# EAGLE design vfd. v1.1brd (EAGLE 5.09)
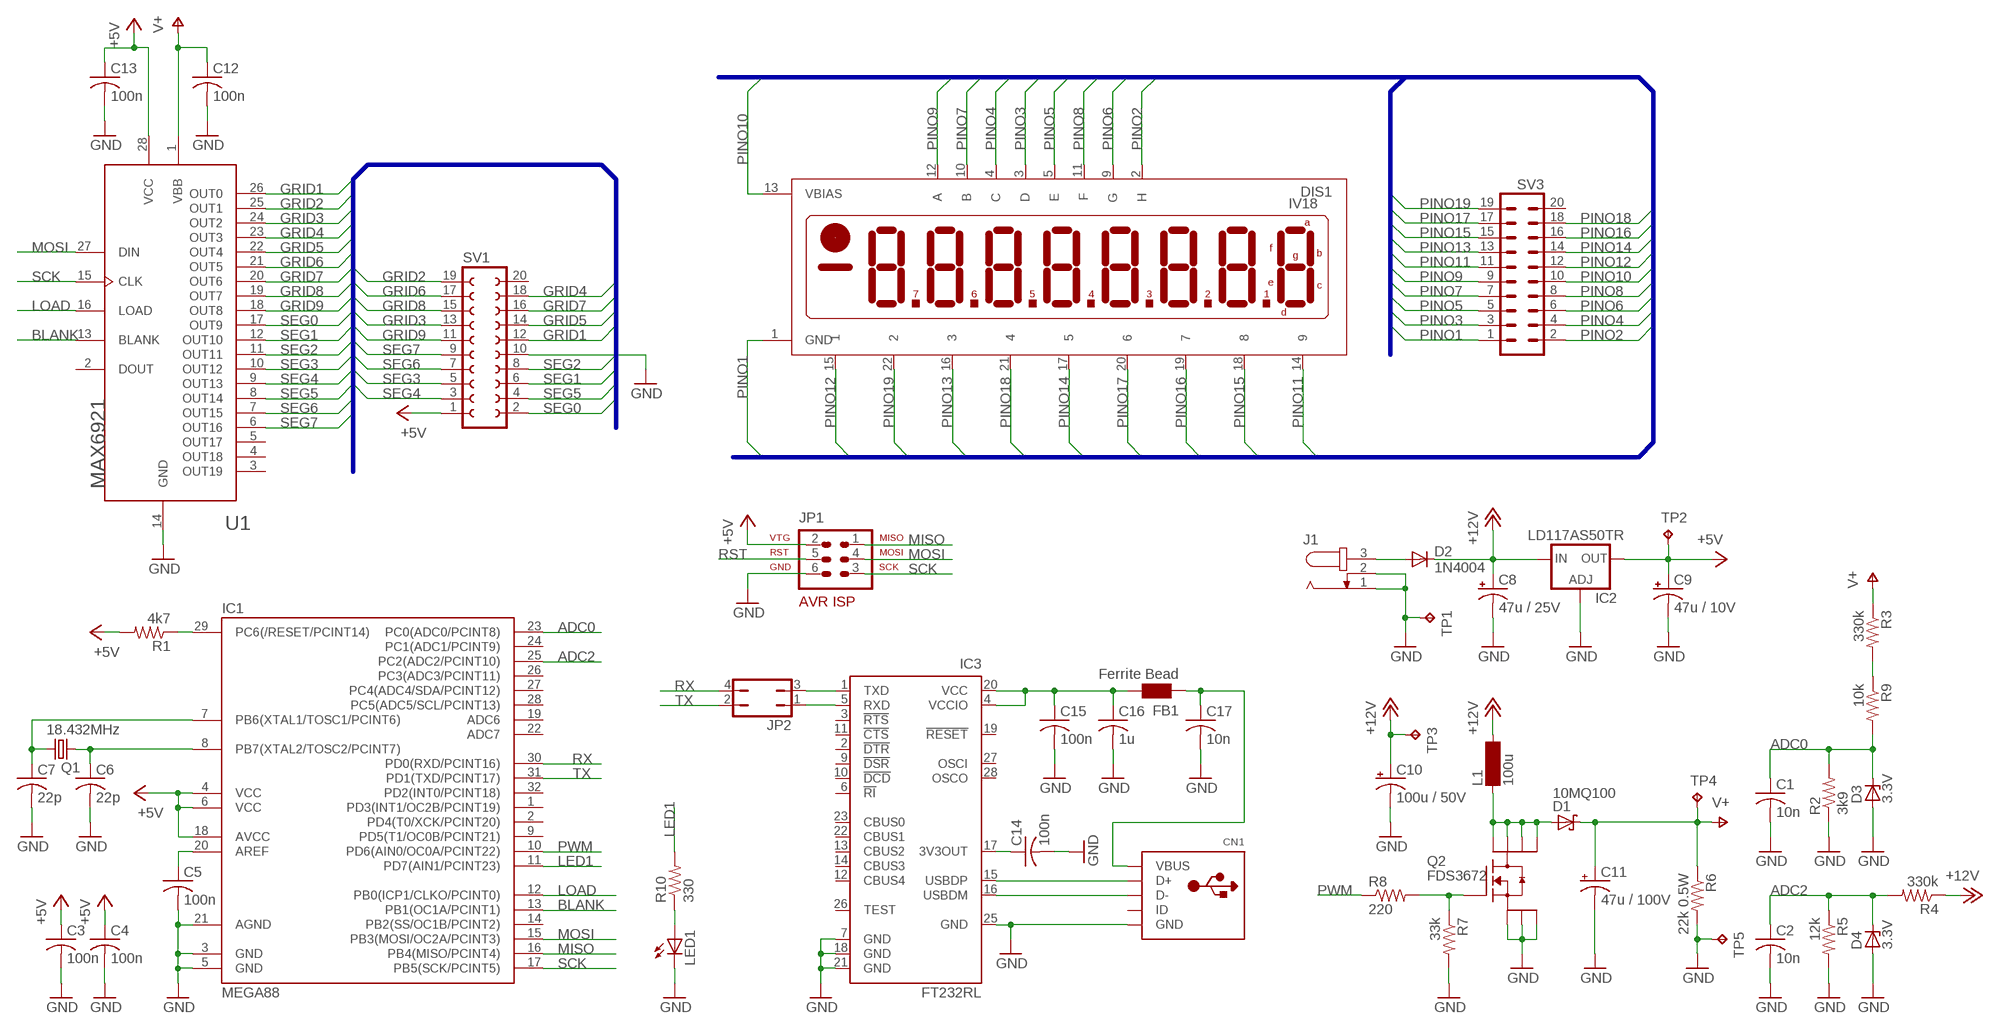
[diagram p0: schematic, sheet 1]

## Parts
C1  10n  C-USC0805  [C0805]
C2  10n  C-USC0805  [C0805]
C3  100n  C-USC0805  [C0805]
C4  100n  C-USC0805  [C0805]
C5  100n  C-USC0805  [C0805]
C6  22p  C-USC0805  [C0805]
C7  22p  C-USC0805  [C0805]
C8  47u / 25V  CPOL-USUD-6,3X5,8  [UD-6,3X5,8_NICHICON]
C9  47u / 10V  CPOL-USUD-6,3X5,8  [UD-6,3X5,8_NICHICON]
C10  100u / 50V  CPOL-USE3.5-8  [E3,5-8]
C11  47u / 100V  CPOL-USE3.5-10  [E3,5-10]
C12  100n  C-US075-032X103  [C075-032X103]
C13  100n  C-USC0805  [C0805]
C14  100n  C-USC0805  [C0805]
C15  100n  C-USC0805  [C0805]
C16  1u  C-USC0805  [C0805]
C17  10n  C-USC0805  [C0805]
CN1  USBMINIB  [USB-MINIB]
D1  10MQ100  [SMA(DO-214AC)]
D2  1N4004  [DO41-10]
D3  3.3V  ZENER-DIODESOD80C  [SOD80C]
D4  3.3V  ZENER-DIODESOD80C  [SOD80C]
DIS1  IV18  [IV18]
FB1  Ferrite Bead  WE-CBF_0603  [0603]
IC1  MEGA88  MEGA48/88/168-AU  [TQFP32-08]
IC2  LD117AS50TR  [SOT223]
IC3  FT232RL  [SSOP28]
J1  JACK-PLUG1  [SPC4078]
JP1  AVR-ISP-6  [AVR-ISP-6]
JP2  JP2Q  [JP2Q]
L1  100u  BS11  [BS11]
LED1  LEDCHIPLED_0805  [CHIPLED_0805]
Q1  18.432MHz  CRYSTALHC49UP  [HC49UP]
Q2  FDS3672  [SO08]
R1  4k7  R-US_R0805  [R0805]
R2  3k9  R-US_R0805  [R0805]
R3  330k  R-US_R0805  [R0805]
R4  330k  R-US_R0805  [R0805]
R5  12k  R-US_R0805  [R0805]
R6  22k 0.5W  R-US_0207/10  [0207/10]
R7  33k  R-US_R0805  [R0805]
R8  220  R-US_R0805  [R0805]
R9  10k  R-US_R0805  [R0805]
R10  330  R-US_R0805  [R0805]
SV1  FE10-2  [FE10-2]
SV3  MA10-2W  [MA10-2W]
TP1  TPPAD1-13  [P1-13]
TP2  TPPAD1-13  [P1-13]
TP3  TPPAD1-13  [P1-13]
TP4  TPPAD1-13  [P1-13]
TP5  TPPAD1-13  [P1-13]
U1  MAX6921W  [SO28W]
U$1  DC-JACK-POLARITY+  [DC-JACK-POL]  (not placed on a sheet)

## Nets
+5V: C3.1 C4.1 C9.+ C13.1 IC1.4(VCC) IC1.6(VCC) IC1.18(AVCC) IC2.4(OUT) JP1.2 R1.2 SV1.1 TP2.TP U1.28(VCC)
+12V: C8.+ C10.+ D2.C IC2.3(IN) L1.2 R4.1 TP3.TP
ADC0: C1.1 D3.C IC1.23(PC0(ADC0/PCINT8)) R2.2 R9.2
ADC2: C2.1 D4.C IC1.25(PC2(ADC2/PCINT10)) R4.2 R5.1
BLANK: IC1.13(PB1(OC1A/PCINT1)) U1.13(BLANK)
GND: C1.2 C2.2 C3.2 C4.2 C5.2 C6.2 C7.2 C8.- C9.- C10.- C11.- C12.2 C13.2 C14.2 C15.2 C16.2 C17.2 CN1.GND D3.A D4.A IC1.3(GND) IC1.5(GND) IC1.21(AGND) IC2.1(ADJ) IC3.7(GND) IC3.18(GND) IC3.21(GND) IC3.25(GND) J1.1 J1.2 JP1.6 LED1.C Q2.1(S1) Q2.2(S2) Q2.3(S3) R2.1 R5.2 R6.2 R7.2 SV1.10 TP1.TP TP5.TP U1.14(GND)
GRID1: SV1.12 U1.26(OUT0)
GRID2: SV1.19 U1.25(OUT1)
GRID3: SV1.13 U1.24(OUT2)
GRID4: SV1.18 U1.23(OUT3)
GRID5: SV1.14 U1.22(OUT4)
GRID6: SV1.17 U1.21(OUT5)
GRID7: SV1.16 U1.20(OUT6)
GRID8: SV1.15 U1.19(OUT7)
GRID9: SV1.11 U1.18(OUT8)
LED1: IC1.11(PD7(AIN1/PCINT23)) R10.2
LOAD: IC1.12(PB0(ICP1/CLKO/PCINT0)) U1.16(LOAD)
MISO: IC1.16(PB4(MISO/PCINT4)) JP1.1
MOSI: IC1.15(PB3(MOSI/OC2A/PCINT3)) JP1.4 U1.27(DIN)
N$1: D2.A J1.3
N$2: C5.1 IC1.20(AREF)
N$3: C6.1 IC1.8(PB7(XTAL2/TOSC2/PCINT7)) Q1.1
N$4: C7.1 IC1.7(PB6(XTAL1/TOSC1/PCINT6)) Q1.2
N$5: D1.A L1.1 Q2.5(D1) Q2.6(D2) Q2.7(D3) Q2.8(D4)
N$6: CN1.D+ IC3.15(USBDP)
N$7: CN1.D- IC3.16(USBDM)
N$8: C15.1 C16.1 FB1.2 IC3.4(VCCIO) IC3.20(VCC)
N$9: C17.1 CN1.VBUS FB1.1
N$10: C14.1 IC3.17(3V3OUT)
N$11: LED1.A R10.1
N$12: IC3.1(TXD) JP2.3
N$13: IC3.5(RXD) JP2.1
N$14: Q2.4(G1) R7.1 R8.2
N$15: R3.2 R9.1
PINO1: DIS1.1(GND) SV3.1
PINO2: DIS1.2(H) SV3.2
PINO3: DIS1.3(D) SV3.3
PINO4: DIS1.4(C) SV3.4
PINO5: DIS1.5(E) SV3.5
PINO6: DIS1.9(G) SV3.6
PINO7: DIS1.10(B) SV3.7
PINO8: DIS1.11(F) SV3.8
PINO9: DIS1.12(A) SV3.9
PINO10: DIS1.13(VBIAS) SV3.10
PINO11: DIS1.14 SV3.11
PINO12: DIS1.15 SV3.12
PINO13: DIS1.16 SV3.13
PINO14: DIS1.17 SV3.14
PINO15: DIS1.18 SV3.15
PINO16: DIS1.19 SV3.16
PINO17: DIS1.20 SV3.17
PINO18: DIS1.21 SV3.18
PINO19: DIS1.22 SV3.19
PWM: IC1.10(PD6(AIN0/OC0A/PCINT22)) R8.1
RST: IC1.29(PC6(/RESET/PCINT14)) JP1.5 R1.1
RX: IC1.30(PD0(RXD/PCINT16)) JP2.4
SCK: IC1.17(PB5(SCK/PCINT5)) JP1.3 U1.15(CLK)
SEG0: SV1.2 U1.17(OUT9)
SEG1: SV1.6 U1.12(OUT10)
SEG2: SV1.8 U1.11(OUT11)
SEG3: SV1.5 U1.10(OUT12)
SEG4: SV1.3 U1.9(OUT13)
SEG5: SV1.4 U1.8(OUT14)
SEG6: SV1.7 U1.7(OUT15)
SEG7: SV1.9 U1.6(OUT16)
TX: IC1.31(PD1(TXD/PCINT17)) JP2.2
V+: C11.+ C12.1 D1.C R3.1 R6.1 TP4.TP U1.1(VBB)
Unconnected: CN1.ID IC1.1(PD3(INT1/OC2B/PCINT19)) IC1.2(PD4(T0/XCK/PCINT20)) IC1.9(PD5(T1/OC0B/PCINT21)) IC1.14(PB2(SS/OC1B/PCINT2)) IC1.19(ADC6) IC1.22(ADC7) IC1.24(PC1(ADC1/PCINT9)) IC1.26(PC3(ADC3/PCINT11)) IC1.27(PC4(ADC4/SDA/PCINT12)) IC1.28(PC5(ADC5/SCL/PCINT13)) IC1.32(PD2(INT0/PCINT18)) IC3.2(!DTR) IC3.3(!RTS) IC3.6(!RI) IC3.9(!DSR) IC3.10(!DCD) IC3.11(!CTS) IC3.12(CBUS4) IC3.13(CBUS2) IC3.14(CBUS3) IC3.19(!RESET) IC3.22(CBUS1) IC3.23(CBUS0) IC3.26(TEST) IC3.27(OSCI) IC3.28(OSCO) SV1.20 SV3.20 U1.2(DOUT) U1.3(OUT19) U1.4(OUT18) U1.5(OUT17)

## Buses
SEG[0..7],GRID[1..9]
PINO[1..19]

## Library data of the parts
C1-C7 C12-C17 = rcl:C-US: CAPACITOR, American symbol
C8-C11 = rcl:CPOL-US: POLARIZED CAPACITOR, American symbol
CN1 = adafruit:USB: USB Connectors USBMINIB - Surface Mount Female Mini-B USB Connector 4UConnector: 06564 By microbuilder.eu Thru-hole RA Female Mini-B USB Connector 4UConnector: 18732 By ladyada.net
D1 = MeusComponentes:10MQ100: Schottky Rectifier, 2.1 A - 100V
D2 = diode-1:1N4004: DIODE general purpose rectifier, 1 A
D3 D4 = diode:ZENER-DIODE: Z-Diode
DIS1 = adafruit:IV18: LCD DISPLAY 8-character 7 segment
FB1 = wuerth-elektronik:WE-CBF: SMD EMI Suppression Ferrite Beads - excellent anti-EMI properties - low DCR - impedances till 3000 ohms - rated current up to 6 A
IC1 = avr-6:MEGA48/88/168
IC2 = v-reg:LD117A?*: Low drop fixed and adjustable positive voltage regulators 1 A Source: http://www.st.com/stonline/products/literature/ds/7194/ld1117axx.pdf
IC3 = ftdichip:FT232R: Source: http://www.ftdichip.com/Documents/DataSheets/DS_FT232R_v104.pdf
J1 = con-jack:JACK-PLUG: DC POWER JACK Power Jack, DC, Right Angle, Through Hole, Rated 5A at 16VDC, PC Terminals Distributor: Farnell (www.Farnell.de) Drawing: 84N1161.pdf / 84N1162.pdf Manufacturer: SPC Technology (www.spctechnology.com) Type: SPC4077 / SPC 4078
JP1 = avr-6:AVR-ISP-6: AVR ISP-6 Serial Programming Header
JP2 = jumper:JP2Q: JUMPER
L1 = inductor-neosid:BS: INDUCTOR nominal inductance, magnetically screened
LED1 = led:LED: LED OSRAM: - CHIPLED LG R971, LG N971, LY N971, LG Q971, LY Q971, LO R971, LY R971 LH N974, LH R974 LS Q976, LO Q976, LY Q976 LO Q996 - Hyper CHIPLED LW Q18S LB Q993, LB Q99A, LB R99A - SideLED LS A670, LO A670, LY A670, LG A670, LP A670 LB A673, LV A673, LT A673, LW A673 LH A674 LY A675 LS A676, LA A676, LO A676, LY A676, LW A676 LS A679, LY A679, LG A679 - Hyper Micro SIDELED® LS Y876, LA Y876, LO Y876, LY Y876 LT Y87S - SmartLED LW L88C, LW L88S LB L89C, LB L89S, LG L890 LS L89K, LO L89K, LY L89K LS L896, LA L896, LO L896, LY L896 - TOPLED LS T670, LO T670, LY T670, LG T670, LP T670 LSG T670, LSP T670, LSY T670, LOP T670, LYG T670 LG T671, LOG T671, LSG T671 LB T673, LV T673, LT T673, LW T673 LH T674 LS T676, LA T676, LO T676, LY T676, LB T676, LH T676, LSB T676, LW T676 LB T67C, LV T67C, LT T67C, LS T67K, LO T67K, LY T67K, LW E67C LS E67B, LA E67B, LO E67B, LY E67B, LB E67C, LV E67C, LT E67C LW T67C LS T679, LY T679, LG T679 LS T770, LO T770, LY T770, LG T770, LP T770 LB T773, LV T773, LT T773, LW T773 LH T774 LS E675, LA E675, LY E675, LS T675 LS T776, LA T776, LO T776, LY T776, LB T776 LHGB T686 LT T68C, LB T68C - Hyper Mini TOPLED® LB M676 - Mini TOPLED Santana® LG M470 LS M47K, LO M47K, LY M47K Source: http://www.osram.convergy.de LUXEON: - LUMILED® LXK2-PW12-R00, LXK2-PW12-S00, LXK2-PW14-U00, LXK2-PW14-V00 LXK2-PM12-R00, LXK2-PM12-S00, LXK2-PM14-U00 LXK2-PE12-Q00, LXK2-PE12-R00, LXK2-PE12-S00, LXK2-PE14-T00, LXK2-PE14-U00 LXK2-PB12-K00, LXK2-PB12-L00, LXK2-PB12-M00, LXK2-PB14-N00, LXK2-PB14-P00, LXK2-PB14-Q00 LXK2-PR12-L00, LXK2-PR12-M00, LXK2-PR14-Q00, LXK2-PR14-R00 LXK2-PD12-Q00, LXK2-PD12-R00, LXK2-PD12-S00 LXK2-PH12-R00, LXK2-PH12-S00 LXK2-PL12-P00, LXK2-PL12-Q00, LXK2-PL12-R00 Source: www.luxeon.com KINGBRIGHT: KA-3528ASYC Source: www.kingbright.com
Q1 = crystal:CRYSTAL: CRYSTAL
Q2 = MeusComponentes:FDS3672: N-Channel PowerTrench® MOSFET 100V, 7.5A, 22mR
R1-R10 = rcl:R-US_: RESISTOR, American symbol
SV1 = con-lsta:FE10-2: FEMALE HEADER
SV3 = con-lstb:MA10-2W: PIN HEADER
TP1-TP5 = testpad:TP: Test pad
U1 = adafruit:MAX6921: MAX6921 76V VFD driver. Can be cascaded, talk to it via SPI The DIL part is from Supertex (HV5812)
U$1 = MeusComponentes:DC-JACK-POLARITY+

## Board
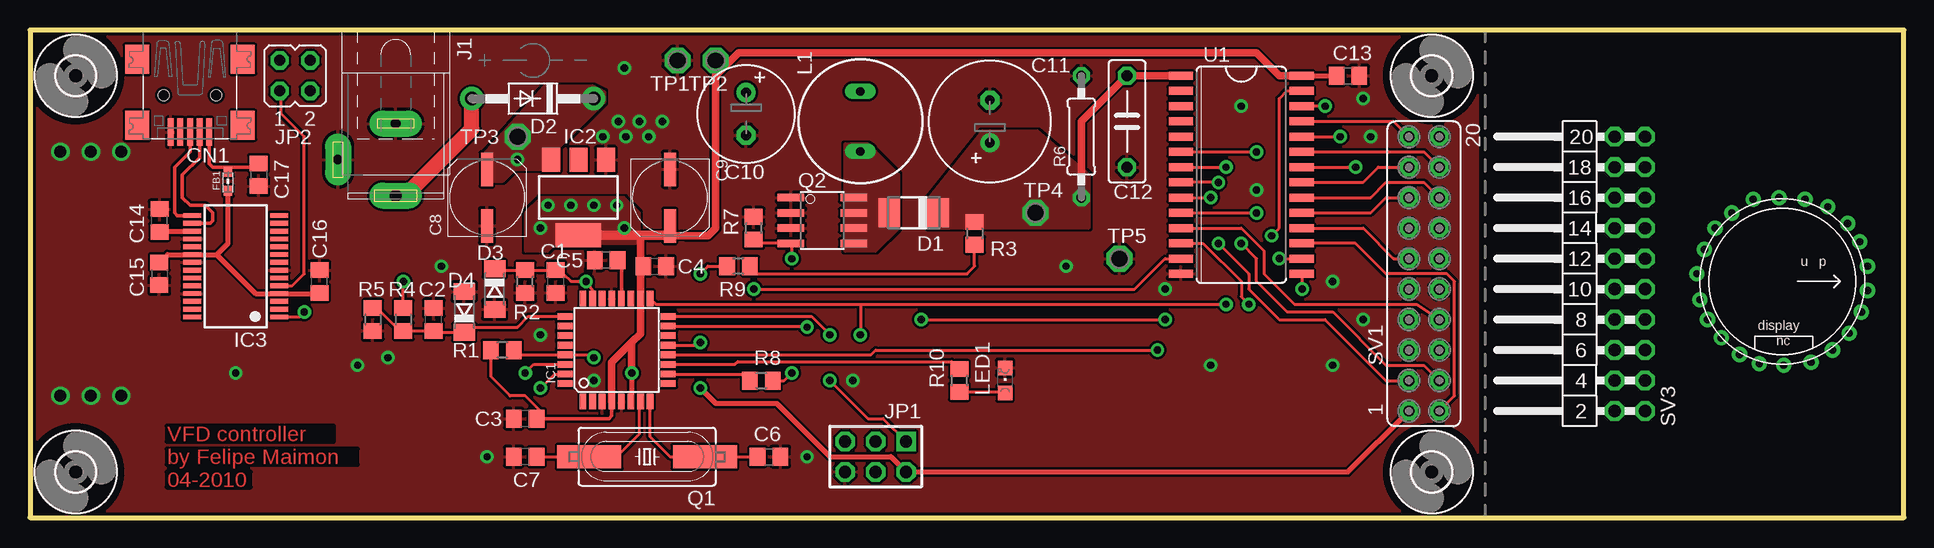
[diagram p1: board, top side]
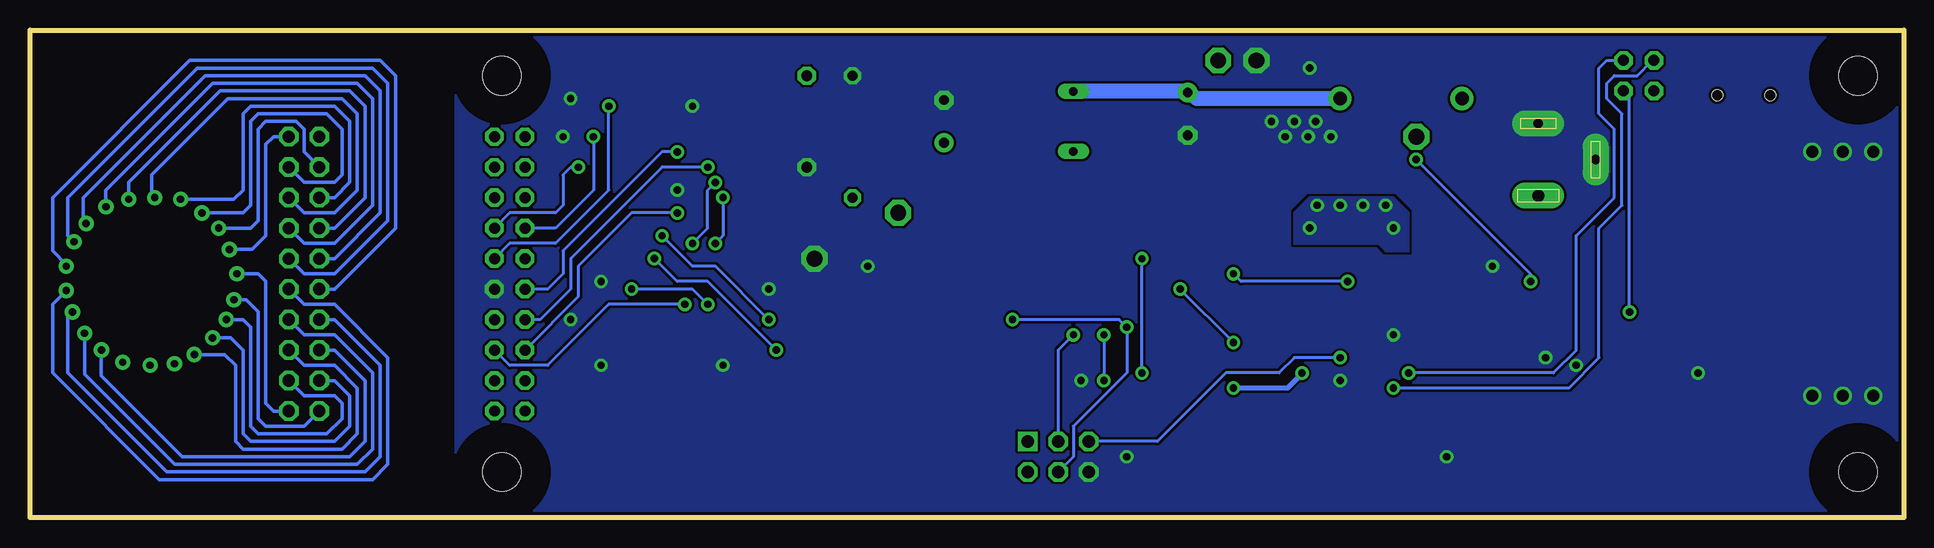
[diagram p2: board, bottom side, seen from below]

Size 156.19 x 40.64 mm. Coordinates in mm from the lower left corner, seen from the top.
Outline: 0,40.64 0,0 156.19,0 156.19,40.64 0,40.64
Copper layers (1*16): Top 0.035mm / dielectric 1.5mm / Bottom 0.035mm
Design rules "SparkFun": minimum track width 8mil, minimum drill 20mil, track to track 8mil, track to pad 8mil, pad to pad 8mil, via to via 8mil, smd to smd 8mil, copper to edge 10mil, drill to drill 8mil, minimum pad ring 12mil, minimum via ring 10mil, stop-mask expansion 4mil, vias tented up to drill 25mil, thermal gap 10mil

### Footprints (pad centres in the part's own frame; a part is rotated, then mirrored left to right if it is on the bottom)
C0805 = smd 1.3 x 1.5: 1 -0.95,0; 2 0.95,0
UD-6,3X5,8_NICHICON = smd 2.8 x 1: + 2.35,0; - -2.35,0
E3,5-8 = drill 0.813 pad 1.6 round: + -1.778,0 | drill 0.813 pad 1.6 octagon: - 1.778,0
E3,5-10 = drill 0.813 pad 1.6 round: + -1.778,0 | drill 0.813 pad 1.6 octagon: - 1.778,0
C075-032X103 = drill 0.914 octagon: 1 -3.81,0; 2 3.81,0
USB-MINIB = smd 0.5 x 2.308: D+ 0,4.064; D- -0.8,4.064; GND 1.6,4.064; ID 0.8,4.064; VBUS -1.6,4.064 | smd 2 x 2.4: GND1 -4.4,-2; GND2 -4.4,3.5; GND3 4.4,3.5; GND4 4.4,-2 | hole 0.9: -2.2,1; 2.2,1
SMA(DO-214AC) = smd 1.8 x 2.4: A -0.515,-1.27; C -4.565,-1.27
DO41-10 = drill 1.118 pad 1.93 round: A 5.08,0; C -5.08,0
SOD80C = smd 1.4 x 1.8: A 1.7,0; C -1.7,0
IV18 = drill 0.61 pad 1.27 round: 1 -0.635,-7.112; 2 1.524,-6.858; 3 3.175,-6.223; 4 4.699,-5.08; 5 6.096,-3.556; 6 6.858,-1.905; 7 6.985,0.127; 8 6.731,2.413; 9 5.715,4.191; 10 4.318,5.588; 11 2.54,6.604; 12 0.762,7.112; 13 -1.27,7.112; 14 -3.302,6.477; 15 -4.826,5.461; 16 -6.223,3.81; 17 -6.858,1.905; 18 -6.985,-0.254; 19 -6.858,-2.413; 20 -5.715,-4.191; 21 -4.445,-5.588; 22 -2.667,-6.477
0603 = smd 0.85 x 0.7: 1 -0.9,0; 2 0.7,0
TQFP32-08 = smd 1.27 x 0.559: 1 -4.293,2.8; 2 -4.293,2; 3 -4.293,1.2; 4 -4.293,0.4; 5 -4.293,-0.4; 6 -4.293,-1.2; 7 -4.293,-2; 8 -4.293,-2.8; 17 4.293,-2.8; 18 4.293,-2; 19 4.293,-1.2; 20 4.293,-0.4; 21 4.293,0.4; 22 4.293,1.2; 23 4.293,2; 24 4.293,2.8 | smd 0.559 x 1.27: 9 -2.8,-4.293; 10 -2,-4.293; 11 -1.2,-4.293; 12 -0.4,-4.293; 13 0.4,-4.293; 14 1.2,-4.293; 15 2,-4.293; 16 2.8,-4.293; 25 2.8,4.293; 26 2,4.293; 27 1.2,4.293; 28 0.4,4.293; 29 -0.4,4.293; 30 -1.2,4.293; 31 -2,4.293; 32 -2.8,4.293
SOT223 = smd 1.5 x 2: 1 -2.3,-3.15; 2 0,-3.15; 3 2.3,-3.15 | smd 3.8 x 2: 4 0,3.15
SSOP28 = smd 0.4 x 1.5: 1 -4.225,-3.625; 2 -3.575,-3.625; 3 -2.925,-3.625; 4 -2.275,-3.625; 5 -1.625,-3.625; 6 -0.975,-3.625; 7 -0.325,-3.625; 8 0.325,-3.625; 9 0.975,-3.625; 10 1.625,-3.625; 11 2.275,-3.625; 12 2.925,-3.625; 13 3.575,-3.625; 14 4.225,-3.625; 15 4.225,3.625; 16 3.575,3.625; 17 2.925,3.625; 18 2.275,3.625; 19 1.625,3.625; 20 0.975,3.625; 21 0.325,3.625; 22 -0.325,3.625; 23 -0.975,3.625; 24 -1.625,3.625; 25 -2.275,3.625; 26 -2.925,3.625; 27 -3.575,3.625; 28 -4.225,3.625
SPC4078 = drill 0.8 pad 2.184 long: 1 -3,0; 2 0,-4.8 | drill 1 pad 2.184 long: 3 3,0
AVR-ISP-6 = drill 1.016 square: 1 -2.54,-1.27 | drill 1.016 octagon: 2 -2.54,1.27; 3 0,-1.27; 4 0,1.27; 5 2.54,-1.27; 6 2.54,1.27
JP2Q = drill 0.914 octagon: 1 -1.27,-1.27; 2 -1.27,1.27; 3 1.27,-1.27; 4 1.27,1.27
BS11 = drill 0.7 long: 1 -2.5,0; 2 2.5,0
CHIPLED_0805 = smd 1.2 x 1.2: A 0,-1.05; C 0,1.05
HC49UP = smd 5.334 x 1.93: 1 -4.826,0; 2 4.826,0
SO08 = smd 0.61 x 2.21: 1 -1.905,-2.616; 2 -0.635,-2.616; 3 0.635,-2.616; 4 1.905,-2.616; 5 1.905,2.616; 6 0.635,2.616; 7 -0.635,2.616; 8 -1.905,2.616
R0805 = smd 1.3 x 1.5: 1 -0.95,0; 2 0.95,0
0207/10 = drill 0.813 octagon: 1 -5.08,0; 2 5.08,0
FE10-2 = drill 0.914 octagon: 1 -11.43,1.27; 2 -11.43,-1.27; 3 -8.89,1.27; 4 -8.89,-1.27; 5 -6.35,1.27; 6 -6.35,-1.27; 7 -3.81,1.27; 8 -3.81,-1.27; 9 -1.27,1.27; 10 -1.27,-1.27; 11 1.27,1.27; 12 1.27,-1.27; 13 3.81,1.27; 14 3.81,-1.27; 15 6.35,1.27; 16 6.35,-1.27; 17 8.89,1.27; 18 8.89,-1.27; 19 11.43,1.27; 20 11.43,-1.27
MA10-2W = drill 1.016 octagon: 1 -11.43,-1.27; 2 -11.43,1.27; 3 -8.89,-1.27; 4 -8.89,1.27; 5 -6.35,-1.27; 6 -6.35,1.27; 7 -3.81,-1.27; 8 -3.81,1.27; 9 -1.27,-1.27; 10 -1.27,1.27; 11 1.27,-1.27; 12 1.27,1.27; 13 3.81,-1.27; 14 3.81,1.27; 15 6.35,-1.27; 16 6.35,1.27; 17 8.89,-1.27; 18 8.89,1.27; 19 11.43,-1.27; 20 11.43,1.27
P1-13 = drill 1.321 pad 2.159 octagon: TP 0,0
SO28W = smd 0.66 x 2.032: 1 -8.255,-5.029; 2 -6.985,-5.029; 3 -5.715,-5.029; 4 -4.445,-5.029; 5 -3.175,-5.029; 6 -1.905,-5.029; 7 -0.635,-5.029; 8 0.635,-5.029; 9 1.905,-5.029; 10 3.175,-5.029; 11 4.445,-5.029; 12 5.715,-5.029; 13 6.985,-5.029; 14 8.255,-5.029; 15 8.255,5.029; 16 6.985,5.029; 17 5.715,5.029; 18 4.445,5.029; 19 3.175,5.029; 20 1.905,5.029; 21 0.635,5.029; 22 -0.635,5.029; 23 -1.905,5.029; 24 -3.175,5.029; 25 -4.445,5.029; 26 -5.715,5.029; 27 -6.985,5.029; 28 -8.255,5.029
3,2 = hole 3.2: 0,0

### Placement (x,y rotation side)
C1  43.81,19.68 270 top
C2  33.66,16.51 90 top
C3  41.27,8.26 180 top
C4  52.07,20.95 0 top
C5  48.02,21.45 180 top
C6  61.59,5.08 0 top
C7  41.27,5.08 180 top
C8  38.1,26.67 90 top
C9  53.34,26.67 270 top
C10  59.69,33.66 270 top
C11  80.01,33.02 90 top
C12  91.44,33.02 270 top
C13  109.86,36.83 0 top
C14  10.79,24.77 90 top
C15  10.79,20.33 270 top
C16  24.13,19.68 90 top
C17  19.05,28.57 270 top
CN1  13.34,36.2 180 top
D1  71.12,24.13 180 top
D2  41.91,34.92 180 top
D3  38.73,19.05 270 top
D4  36.2,17.14 90 top
DIS1  146.05,19.68 270 top
FB1  16.51,27.94 270 top
IC1  48.9,13.97 90 top
IC2  45.72,26.67 180 top
IC3  17.14,20.95 90 top
J1  30.48,29.84 270 top
JP1  70.48,5.08 180 top
JP2  22.09,36.83 0 top
L1  69.22,33.02 90 top
LED1  81.28,11.43 0 top
Q1  51.44,5.08 180 top
Q2  66.04,24.77 270 top
R1  39.37,13.97 180 top
R2  41.27,19.68 90 top
R3  78.74,23.7 270 top
R4  31.11,16.51 270 top
R5  28.57,16.51 270 top
R6  87.63,31.75 90 top
R7  60.33,24.13 90 top
R8  60.96,11.43 0 top
R9  59.05,20.95 180 top
R10  77.47,11.43 90 top
SV1  116.2,20.32 90 top
SV3  133.35,20.32 90 top
TP1  53.98,38.1 180 top
TP2  57.15,38.1 180 top
TP3  40.64,31.75 0 top
TP4  83.82,25.4 0 top
TP5  90.81,21.59 0 top
U1  100.97,28.57 270 top
U$1  41.91,38.1 180 top
U$2  [3,2]  116.84,36.83 0 top
U$3  [3,2]  116.84,3.81 0 top
U$4  [3,2]  3.81,3.81 0 top
U$5  [3,2]  3.81,36.83 0 top

### Tracks (layer width: path | path; a pad name or v marks a point on that pad's centre or on a via)
+5V  (via drill 0.61)
  Top 0.254: R1.2 38.42,11.74 40.01,10.16 41.27,10.16 42.55,8.89 42.55,8.57 C3.1
  Top 0.305: 50.9,20.95 C4.1 | IC1.4 48.49,8.49 48.26,8.26 C3.1
  Top 0.406: U1.28 C13.1 | 50.9,23.4 54.61,23.5 | SV1.1 109.86,3.81 JP1.2 71.75,5.08 66.67,5.08 62.23,9.53 57.15,9.53 v55.88,10.79 | IC1.6 50.16,9.75 v50.16,12.06 | 44.45,23.5 45.7,23.5 IC2.4
  Top 0.61: IC1.4 48.49,12.94 50.16,14.61 | 53.34,23.5 54.61,23.5 56.52,23.5 57.15,24.13 57.15,36.83 | 50.9,23.4 50.9,20.95 IC1.18 50.9,15.34 50.16,14.61 | 57.15,36.83 59.05,38.73 102.23,38.73 104.14,36.83 U1.28 | 50.16,14.61 v50.16,12.06 | 57.15,36.83 TP2.TP
  Top 0.813: IC2.4 46.33,23.52 53.34,23.5 C9.+
  Bottom 0.406: v55.88,10.79 51.37,10.79 50.16,11.99 v50.16,12.06
  other vias: 43.18,26.04 42.55,24.13 45.09,26.04 46.99,26.04 48.9,26.04 49.53,24.13
  pour Top (no thermals): 43.81,22.86 50.8,22.86 50.8,25.4 49.53,26.67 42.55,26.67 41.27,25.4 41.27,22.23 43.18,22.23
  pour Bottom (no thermals): 41.27,22.23 41.27,25.4 42.55,26.67 49.53,26.67 50.8,25.4 50.8,22.86 43.81,22.86 43.18,22.23
+12V  (via drill 0.61)
  Top 0.254: R4.1 v31.11,19.68
  Bottom 0.254: v31.11,19.68 31.11,20.32 v40.64,29.84
  Bottom 1.27: L1.2 59.78,35.52 C10.+ 58.93,34.92 D2.C
  pour Top (no thermals): 37.76,28 37.76,30.23 42.89,36 46.89,36 47.89,35.5 47.89,34.63 44.12,30.86 44.12,29 40.39,29 39.39,28
ADC0  (via drill 0.6, 0.61)
  Top 0.254: IC1.23 46.9,18.95 v46.35,19.68 45.09,19.68 44.45,20.32 44.13,20.32 C1.1 R2.2 38.85,20.64 D3.C | R9.2 56.52,20.95 v55.88,20.32
  Bottom 0.254: v55.88,20.32 55.24,19.68 v46.35,19.68
ADC2
  Top 0.254: C2.1 R4.2 30.8,15.56 29.21,17.14 28.89,17.14 R5.1 | IC1.25 41.53,16.77 40.64,15.88 36.83,15.88 36.4,15.45 D4.C 33.77,15.45 C2.1 | C2.1 33.97,15.88
BLANK  (via drill 0.61)
  Top 0.254: U1.13 94.61,21.59 92.08,19.05 v60.33,19.05 | IC1.13 55.65,14.37 v55.88,14.61
  Bottom 0.254: v55.88,14.61 v60.33,19.05
GND  (via drill 0.61, 1)
  other vias: 42.55,15.24 46.99,11.43 38.1,5.08 64.77,5.08 17.14,12.06 29.84,13.34 34.29,20.95 100.97,34.29 98.42,12.7 86.36,20.95 108.58,12.7 102.23,27.3 94.61,19.05 111.12,34.92 49.53,37.47 49.03,33.02 50.8,33.02 52.7,33.02 47.76,31.75 49.66,31.75 51.57,31.75 2.54,10.16 5.08,10.16 2.54,30.48 5.08,30.48 7.62,30.48 7.62,10.16 108.58,19.68 111.12,16.51 111.76,31.75 27.3,12.7 68.58,11.43
  pour Top (rank 2): 0,0 0,40.64 120.65,40.64 120.65,0
  pour Bottom (rank 2, no thermals): 0,0 120.65,0 120.65,40.64 0,40.64
GRID1  (via drill 0.61)
  Top 0.254: v107.95,34.29 U1.26
  Bottom 0.254: SV1.12 116.2,22.86 112.39,22.86 107.95,27.3 v107.95,34.29
GRID2
  Top 0.254: U1.25 113.67,33.02 SV1.19
GRID3  (via drill 0.61)
  Top 0.254: U1.24 v109.22,31.75
  Bottom 0.254: SV1.13 112.39,24.13 109.22,27.3 v109.22,31.75
GRID4
  Top 0.254: SV1.18 116.2,30.48 U1.23
GRID5  (via drill 0.61)
  Top 0.254: U1.22 v110.49,29.21
  Bottom 0.254: SV1.14 116.2,25.4 112.39,25.4 111.76,26.04 111.76,28.57 111.12,29.21 v110.49,29.21
GRID6
  Top 0.254: U1.21 111.12,27.94 112.39,29.21 SV1.17
GRID7
  Top 0.254: SV1.16 116.2,27.94 113.03,27.94 111.76,26.67 U1.20
GRID8
  Top 0.254: SV1.15 113.03,26.67 111.76,25.4 U1.19
GRID9
  Top 0.254: U1.18 111.12,24.13 113.67,21.59 SV1.11
LED1
  Top 0.254: IC1.11 58.77,12.77 59,13 76.85,13 R10.2
LOAD  (via drill 0.61)
  Top 0.254: v104.14,21.59 U1.16 | IC1.12 70.08,13.57 70.48,13.97 v93.98,13.97
  Bottom 0.254: v104.14,21.59 102.23,19.68 99.69,19.68 v93.98,13.97
MISO  (via drill 0.61)
  Top 0.254: IC1.16 65.14,16.77 v66.67,15.24 | v66.67,11.43 69.85,8.26 71.12,8.26 JP1.1
  Bottom 0.254: v66.67,15.24 v66.67,11.43
MOSI  (via drill 0.61)
  Top 0.254: IC1.15 64.67,15.97 v64.77,15.88 | U1.27 104.78,35.56 104.14,34.92 104.14,24.13 v103.5,23.5 | v74.3,16.51 v94.61,16.51
  Bottom 0.254: JP1.4 69.22,5.08 69.22,7.62 64.77,12.06 v64.77,15.88 65.41,16.51 v74.3,16.51 | v103.5,23.5 100.97,20.95 99.06,20.95 v94.61,16.51
N$1
  Top 1.27: J1.3 31.29,26.84 36.83,32.38 D2.A
N$2
  Top 0.305: IC1.20 49.3,20.87 C5.1
N$3
  Top 0.254: C6.1 Q1.1 53.34,5.08 51.7,6.72 IC1.8
N$4
  Top 0.254: C7.1 Q1.2 48.9,5.08 50.8,6.99 50.8,9.53 50.9,9.62 IC1.7
N$5
  pour Top (no thermals): 67.94,31.11 67.94,22.23 70.48,22.23 72.39,24.13 72.39,28.57 69.85,31.11
N$6
  Top 0.305: CN1.D+ 13.34,30.48 12.06,29.21 12.06,25.4 12.29,25.18 IC3.15
N$7
  Top 0.305: IC3.16 15.01,24.53 15.24,24.77 15.24,25.4 14.61,26.04 13.34,26.04 12.7,26.67 12.7,28.57 14.13,30.01 CN1.D-
N$8
  Top 0.406: FB1.2 16.51,22.86 15.58,21.93 | 15.58,21.93 IC3.20 11.47,21.93 10.82,21.28 C15.1 | C16.1 24.07,18.68 IC3.4 18.83,18.68 15.58,21.93
N$9
  Top 0.305: CN1.VBUS 14.94,29.52 15.24,29.21 16.51,29.21 | 16.51,29.21 18.73,29.21 C17.1 | 16.51,29.21 FB1.1
N$10
  Top 0.406: IC3.17 10.86,23.88 C14.1
N$11
  Top 0.254: R10.1 81.18,10.48 LED1.A
N$12  (via drill 0.61)
  Top 0.254: IC3.1 22.45,16.73 v22.86,17.14
  Bottom 0.254: v22.86,17.14 22.86,35.06 JP2.3
N$13
  Top 0.254: IC3.5 21.87,19.33 22.86,20.32 22.86,31.75 20.95,33.66 20.95,35.42 JP2.1
N$14  (via drill 0.6)
  Top 0.254: R8.2 62.87,11.43 v63.5,12.06 | v63.5,21.59 63.5,22.78 Q2.4 60.65,22.86 R7.1
  Bottom 0.254: v63.5,12.06 v63.5,21.59
N$15
  Top 0.254: R3.2 78.74,20.95 78.11,20.32 60.64,20.32 R9.1
PINO1
  Bottom 0.305: DIS1.1 137.16,20.32 136.53,19.68 136.53,9.53 135.89,8.89 SV3.1
PINO2
  Bottom 0.305: SV3.2 133.35,7.62 136.53,7.62 137.16,8.26 137.16,17.14 138.18,18.16 DIS1.2
PINO3
  Bottom 0.305: DIS1.3 138.43,16.51 137.79,15.88 137.79,7.62 137.16,6.99 131.44,6.99 130.18,8.26 130.18,9.53 130.81,10.16 133.35,10.16 SV3.3
PINO4
  Bottom 0.305: SV3.4 130.81,11.43 129.54,10.16 129.54,7.62 130.81,6.35 137.79,6.35 138.43,6.99 138.43,13.97 139.45,14.99 DIS1.4
PINO5
  Bottom 0.305: DIS1.5 139.95,13.59 139.06,12.7 139.06,6.35 138.43,5.71 130.18,5.71 128.91,6.99 128.91,10.79 130.81,12.7 133.35,12.7 SV3.5
PINO6
  Bottom 0.305: SV3.6 130.81,13.97 128.27,11.43 128.27,6.35 129.54,5.08 143.51,5.08 150.24,11.81 DIS1.9
PINO7
  Bottom 0.305: DIS1.10 151.64,11.94 144.15,4.45 128.91,4.45 127.64,5.71 127.64,12.06 130.81,15.24 133.35,15.24 SV3.7
PINO8
  Bottom 0.305: SV3.8 130.81,16.51 127,12.7 127,5.08 128.27,3.81 144.78,3.81 153.03,12.06 153.03,16.76 DIS1.11
PINO9
  Bottom 0.305: SV3.9 133.35,17.78 130.81,17.78 126.36,13.34 126.36,4.45 127.64,3.17 145.41,3.17 154.31,12.06 154.31,17.78 DIS1.12
PINO10
  Bottom 0.305: DIS1.13 153.16,21.08 154.31,22.23 154.31,26.67 142.88,38.1 127,38.1 125.73,36.83 125.73,24.13 130.81,19.05 SV3.10
PINO11
  Bottom 0.305: SV3.11 133.35,20.32 130.81,20.32 126.36,24.77 126.36,36.2 127.64,37.47 142.24,37.47 153.03,26.67 153.03,23.5 DIS1.14
PINO12
  Bottom 0.305: DIS1.15 151.76,24.77 151.76,26.67 141.6,36.83 128.27,36.83 127,35.56 127,25.4 130.81,21.59 SV3.12
PINO13
  Bottom 0.305: SV3.13 133.35,22.86 130.81,22.86 127.64,26.04 127.64,34.92 128.91,36.2 140.97,36.2 149.86,27.3 DIS1.16
PINO14
  Bottom 0.305: DIS1.17 147.96,27.94 140.34,35.56 129.54,35.56 128.27,34.29 128.27,26.67 130.81,24.13 SV3.14
PINO15
  Bottom 0.305: SV3.15 133.35,25.4 130.81,25.4 128.91,27.3 128.91,33.66 130.18,34.92 139.7,34.92 146.05,28.57 146.05,27.3 DIS1.18
PINO16
  Bottom 0.305: DIS1.19 139.19,26.54 138.43,27.3 138.43,33.66 137.79,34.29 130.81,34.29 129.54,33.02 129.54,27.94 130.81,26.67 SV3.16
PINO17
  Bottom 0.305: SV3.17 133.35,27.94 130.81,27.94 130.18,28.57 130.18,32.38 131.44,33.66 137.16,33.66 137.79,33.02 137.79,26.04 138.43,25.4 DIS1.20
PINO18
  Bottom 0.305: DIS1.21 137.79,24.13 137.16,24.77 137.16,32.38 136.53,33.02 133.99,33.02 133.35,32.38 133.35,30.48 SV3.18
PINO19
  Bottom 0.305: DIS1.22 137.67,22.35 136.53,23.5 136.53,31.11 135.89,31.75 SV3.19
PWM
  Top 0.254: IC1.10 59.47,11.97 R8.1
RST  (via drill 0.61)
  Top 0.254: v46.99,13.34 46.76,13.57 IC1.29 40.72,13.57
  Top 0.406: R1.1 40.72,13.57
  Bottom 0.254: v46.99,13.34 50.8,13.34 52.07,12.06 56.52,12.06 62.23,6.35 JP1.5
RX  (via drill 0.61)
  Top 0.254: IC1.30 41.98,12.77 v41.27,12.06
  Bottom 0.254: v41.27,12.06 29.21,12.06 27.3,13.97 27.3,23.5 24.13,26.67 24.13,32.38 25.4,33.66 25.4,37.47 24.77,38.1 JP2.4
SCK  (via drill 0.61)
  Top 0.254: v106.05,19.05 106.05,20.27 | 69.22,17.78 52.18,17.78 IC1.17 | 69.22,17.78 v99.69,17.78 | 69.22,17.78 v69.22,15.24
  Top 0.305: 106.05,20.27 U1.15
  Bottom 0.254: v99.69,17.78 100.97,19.05 v106.05,19.05 | v69.22,15.24 70.48,13.97 JP1.3
SEG0
  Top 0.254: SV1.2 118.75,10.16 118.75,19.68 118.11,20.32 113.03,20.32 110.49,22.86 U1.17
SEG1  (via drill 0.61)
  Top 0.254: v101.6,17.78 100.97,18.41 100.97,19.68 97.79,22.86 U1.12
  Bottom 0.254: SV1.6 116.2,12.7 113.03,12.7 107.95,17.78 v101.6,17.78
SEG2
  Top 0.254: SV1.8 115.57,17.78 105.41,17.78 102.87,20.32 102.87,22.23 100.97,24.13 U1.11
SEG3  (via drill 0.61)
  Top 0.254: U1.10 v102.23,25.4
  Bottom 0.254: SV1.5 110.49,18.41 110.49,20.95 106.05,25.4 v102.23,25.4
SEG4  (via drill 0.61)
  Top 0.254: SV1.3 113.03,11.43 107.95,16.51 104.14,16.51 101.6,19.05 101.6,20.32 v99.06,22.86 | U1.9 v98.42,26.67
  Bottom 0.254: v99.06,22.86 98.42,23.5 v98.42,26.67
SEG5  (via drill 0.61)
  Top 0.254: SV1.4 116.2,12.7 113.03,12.7 108.58,17.14 104.78,17.14 102.23,19.68 102.23,21.59 v100.97,22.86 | v99.06,27.94 U1.8
  Bottom 0.254: v100.97,22.86 99.69,24.13 99.69,27.3 v99.06,27.94
SEG6  (via drill 0.61)
  Top 0.254: U1.7 v99.69,29.21
  Bottom 0.254: SV1.7 113.67,16.51 111.12,19.05 111.12,21.59 103.5,29.21 v99.69,29.21
SEG7  (via drill 0.61)
  Top 0.254: U1.6 v102.23,30.48
  Bottom 0.254: SV1.9 113.03,19.05 111.76,20.32 111.76,22.23 103.5,30.48 v102.23,30.48
TX  (via drill 0.61)
  Top 0.254: IC1.31 43.72,11.97 v42.55,10.79
  Bottom 0.254: JP2.2 20.95,38.1 22.23,36.83 24.13,36.83 24.77,36.2 24.77,34.92 23.5,33.66 23.5,26.04 25.4,24.13 25.4,13.34 27.94,10.79 v42.55,10.79
V+
  Top 0.61: R6.1 87.63,33.02 C12.1 U1.1
  pour Top (isolate 0.635, no thermals): 74.93,24.13 74.93,26.67 79.38,32.25 83.95,32.25 88.27,28.57 88.27,24.13

### Text on the board
Top: VFD controller | by Felipe Maimon | 04-2010
bDocu: TX | RX